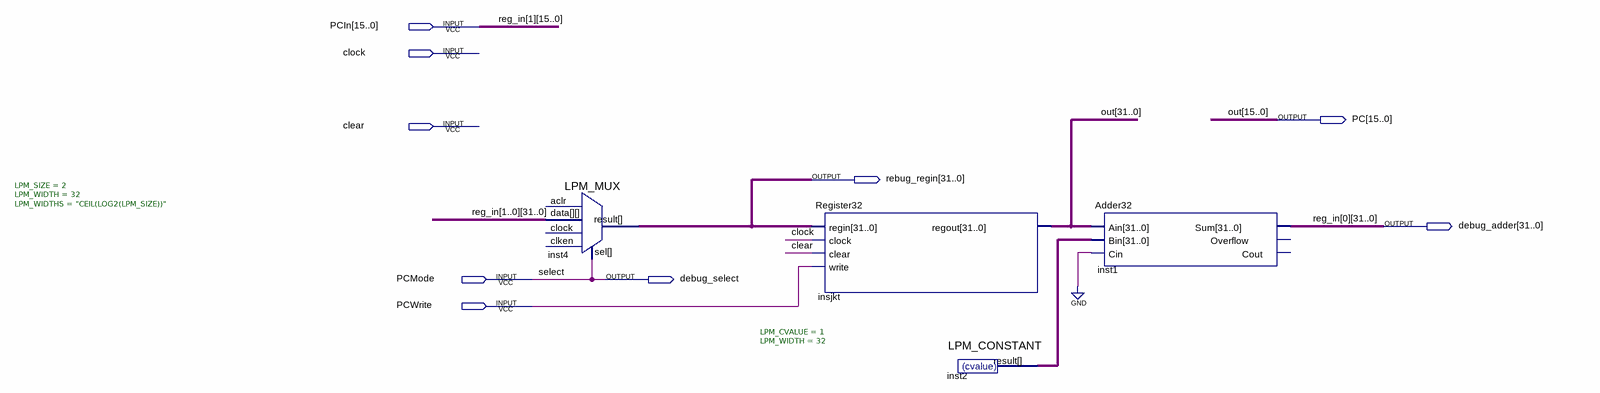
[diagram p0: schematic sheet]
// Quartus schematic PC.bdf as structural Verilog: 4 symbols, 9 pins
module PC (
  input  [15:0] PCIn,
  input  clock,
  input  clear,
  input  PCMode,
  input  PCWrite,
  output [15:0] PC,
  output [31:0] rebug_regin,
  output [31:0] debug_adder,
  output debug_select
);

  wire [31:0] inst2_result;
  wire [31:16] out, reg_in_1;

  LPM_MUX #(.LPM_SIZE(2), .LPM_WIDTH(32), .LPM_WIDTHS("CEIL(LOG2(LPM_SIZE))")) inst4 (
    .data({reg_in_1, PCIn, debug_adder}), .sel(PCMode), .result(rebug_regin));  // open: clock, aclr, clken
  Register32 insjkt (.regin(rebug_regin), .clock(clock), .clear(clear), .write(PCWrite), .regout({out, PC}));
  LPM_CONSTANT #(.LPM_CVALUE(1), .LPM_WIDTH(32)) inst2 (.result(inst2_result));
  Adder32 inst1 (.Ain({out, PC}), .Bin(inst2_result), .Cin(1'b0), .Sum(debug_adder));  // open: Overflow, Cout

  assign debug_select = PCMode;

  // Other names for the same wires on the sheet: out[15:0] = PC; reg_in_0[31:0] = debug_adder; reg_in_1[15:0] = PCIn;
  //   select = PCMode
endmodule
